# Altium schematic sheet FPGA.SchDoc
size 1270 x 1270 mm
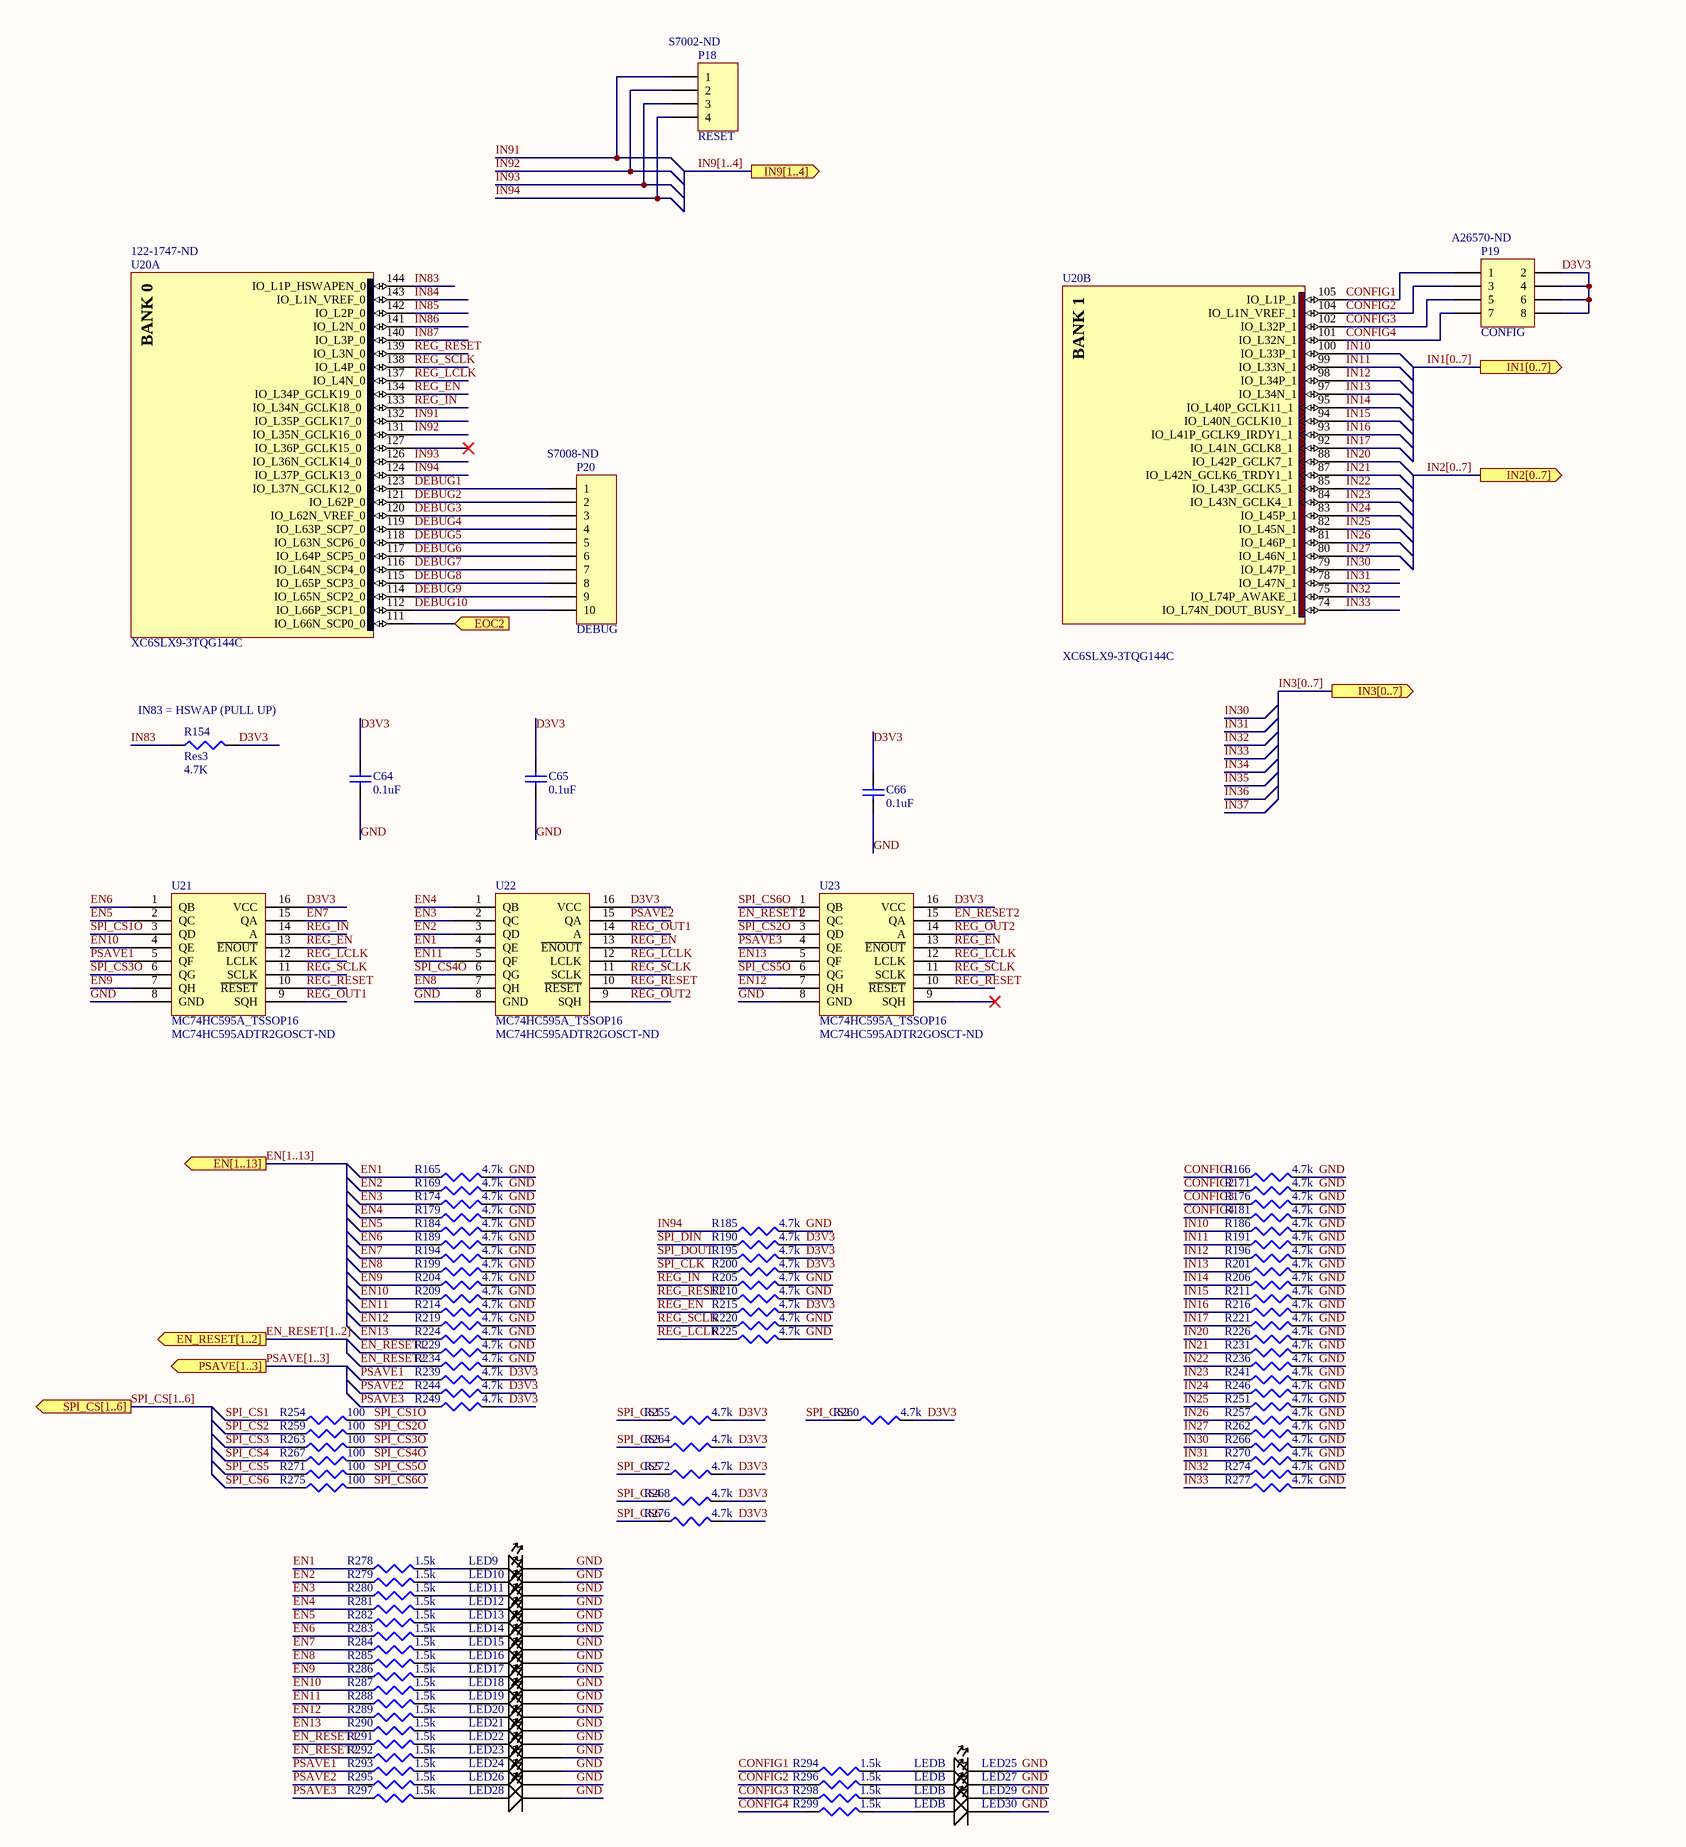
[diagram p0: FPGA.SchDoc, top left]
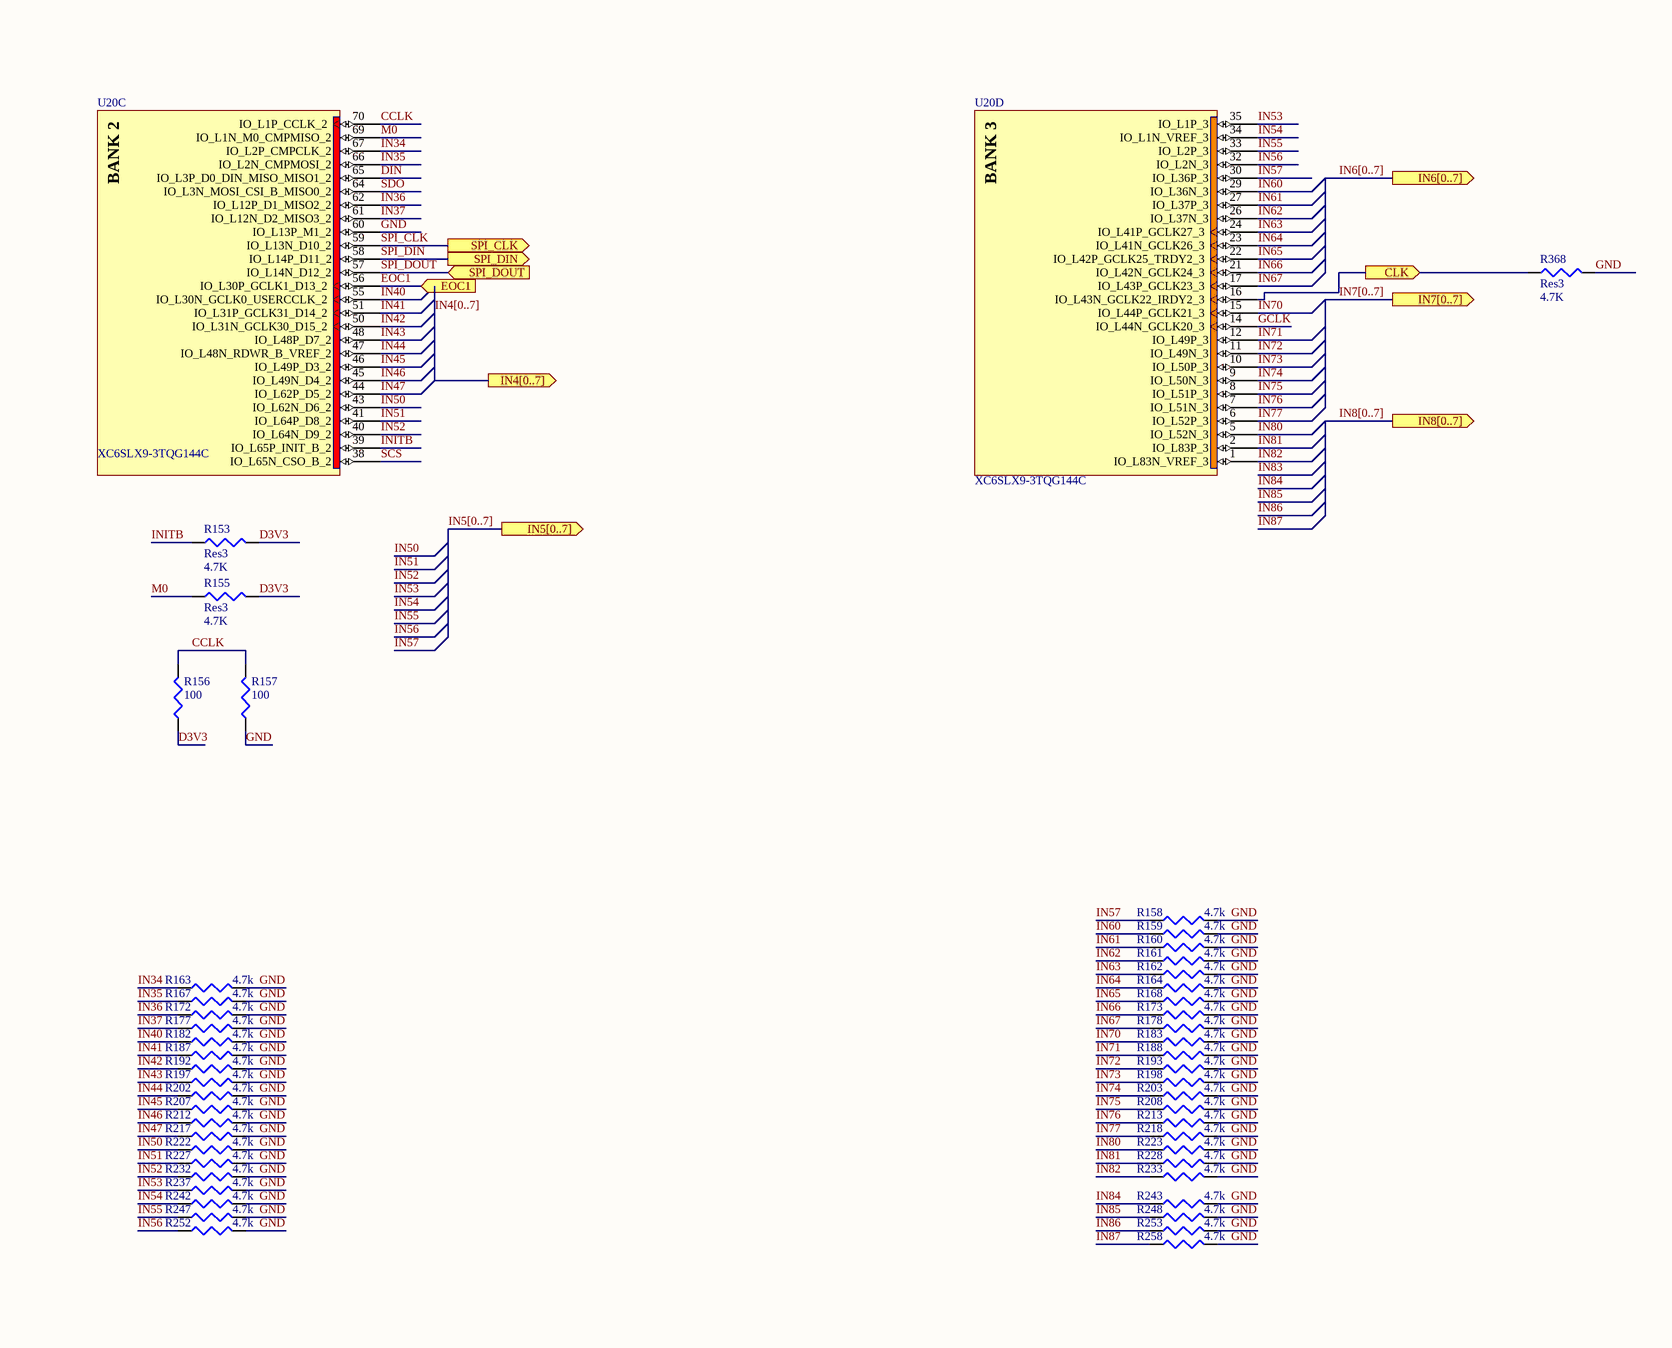
[diagram p1: FPGA.SchDoc, top right]
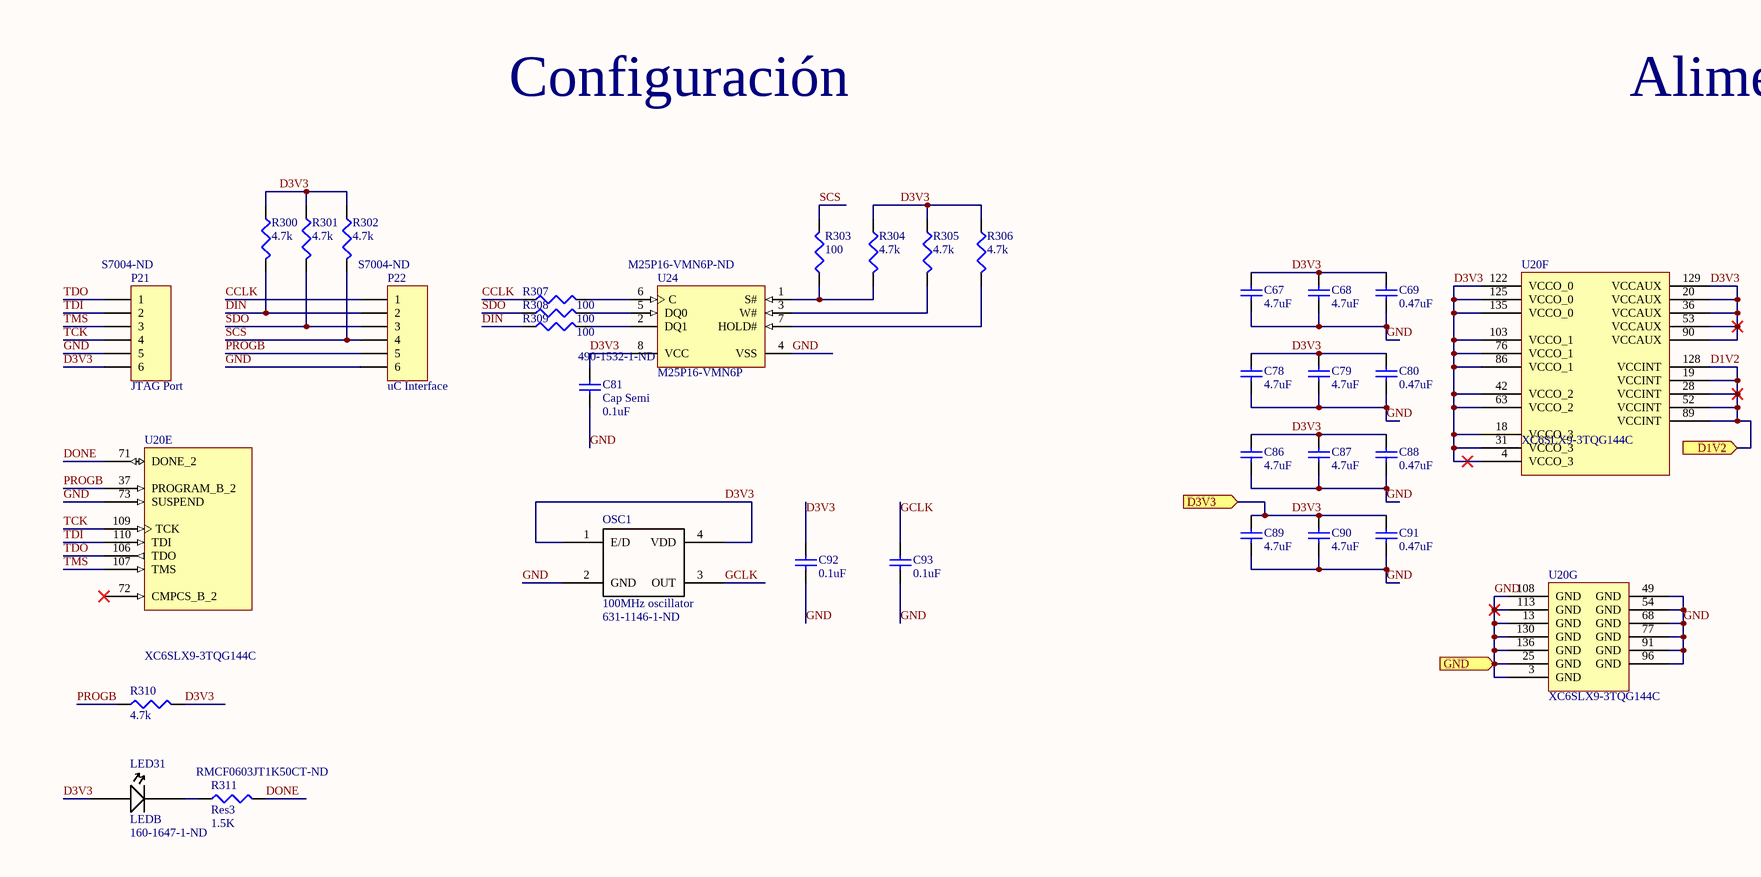
[diagram p2: FPGA.SchDoc, bottom left]
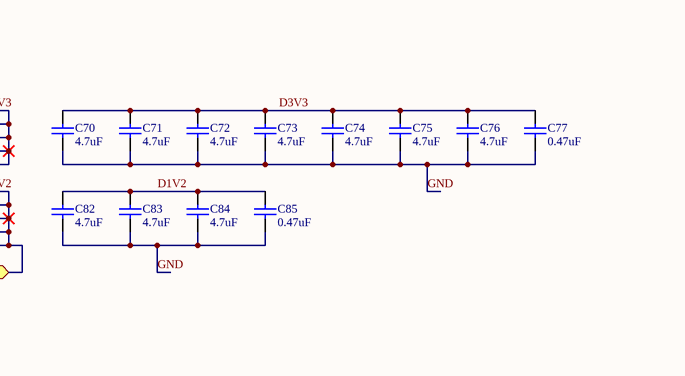
[diagram p3: FPGA.SchDoc, bottom right]

## Parts
C64  value 0.1uF  [J1-0603]  (hidden comment: Cap)
C65  value 0.1uF  [J1-0603]  (hidden comment: Cap)
C66  value 0.1uF  [J1-0603]  (hidden comment: Cap)
C67  value 4.7uF  [J1-0603]  (hidden comment: Cap)
C68  value 4.7uF  [J1-0603]  (hidden comment: Cap)
C69  value 0.47uF  [J1-0603]  (hidden comment: Cap)
C70  value 4.7uF  [J1-0603]  (hidden comment: Cap)
C71  value 4.7uF  [J1-0603]  (hidden comment: Cap)
C72  value 4.7uF  [J1-0603]  (hidden comment: Cap)
C73  value 4.7uF  [J1-0603]  (hidden comment: Cap)
C74  value 4.7uF  [J1-0603]  (hidden comment: Cap)
C75  value 4.7uF  [J1-0603]  (hidden comment: Cap)
C76  value 4.7uF  [J1-0603]  (hidden comment: Cap)
C77  value 0.47uF  [J1-0603]  (hidden comment: Cap)
C78  value 4.7uF  [J1-0603]  (hidden comment: Cap)
C79  value 4.7uF  [J1-0603]  (hidden comment: Cap)
C80  value 0.47uF  [J1-0603]  (hidden comment: Cap)
C81  Cap Semi  value 0.1uF  Supplier Part Number 1: 490-1532-1-ND  [J1-0603]
C82  value 4.7uF  [J1-0603]  (hidden comment: Cap)
C83  value 4.7uF  [J1-0603]  (hidden comment: Cap)
C84  value 4.7uF  [J1-0603]  (hidden comment: Cap)
C85  value 0.47uF  [J1-0603]  (hidden comment: Cap)
C86  value 4.7uF  [J1-0603]  (hidden comment: Cap)
C87  value 4.7uF  [J1-0603]  (hidden comment: Cap)
C88  value 0.47uF  [J1-0603]  (hidden comment: Cap)
C89  value 4.7uF  [J1-0603]  (hidden comment: Cap)
C90  value 4.7uF  [J1-0603]  (hidden comment: Cap)
C91  value 0.47uF  [J1-0603]  (hidden comment: Cap)
C92  value 0.1uF  [J1-0603]  (hidden comment: Cap)
C93  value 0.1uF  [J1-0603]  (hidden comment: Cap)
LED9  LED  [LED]  (value not drawn)
LED10  LED  [LED]  (value not drawn)
LED11  LED  [LED]  (value not drawn)
LED12  LED  [LED]  (value not drawn)
LED13  LED  [LED]  (value not drawn)
LED14  LED  [LED]  (value not drawn)
LED15  LED  [LED]  (value not drawn)
LED16  LED  [LED]  (value not drawn)
LED17  LED  [LED]  (value not drawn)
LED18  LED  [LED]  (value not drawn)
LED19  LED  [LED]  (value not drawn)
LED20  LED  [LED]  (value not drawn)
LED21  LED  [LED]  (value not drawn)
LED22  LED  [LED]  (value not drawn)
LED23  LED  [LED]  (value not drawn)
LED24  LED  [LED]  (value not drawn)
LED25  LEDB  [LED]
LED26  LED  [LED]  (value not drawn)
LED27  LEDB  [LED]
LED28  LED  [LED]  (value not drawn)
LED29  LEDB  [LED]
LED30  LEDB  [LED]
LED31  LEDB  Supplier Part Number 1: 160-1647-1-ND  [LED]
OSC1  100MHz oscillator  Supplier Part Number 1: 631-1146-1-ND  [100MHz oscillator]
P18  RESET  Supplier Part Number 1: S7002-ND  [HDR1X4]
P19  CONFIG  Supplier Part Number 1: A26570-ND  [HDR2X4]
P20  DEBUG  Supplier Part Number 1: S7008-ND  [HDR1X10]
P21  JTAG Port  Supplier Part Number 1: S7004-ND  [HDR1X6]
P22  uC Interface  Supplier Part Number 1: S7004-ND  [HDR1X6]
R153  Res3  value 4.7K  [J1-0603]
R154  Res3  value 4.7K  [J1-0603]
R155  Res3  value 4.7K  [J1-0603]
R156  value 100  [J1-0603]  (hidden comment: Res3)
R157  value 100  [J1-0603]  (hidden comment: Res3)
R158  value 4.7k  [J1-0603]  (hidden comment: Res3)
R159  value 4.7k  [J1-0603]  (hidden comment: Res3)
R160  value 4.7k  [J1-0603]  (hidden comment: Res3)
R161  value 4.7k  [J1-0603]  (hidden comment: Res3)
R162  value 4.7k  [J1-0603]  (hidden comment: Res3)
R163  value 4.7k  [J1-0603]  (hidden comment: Res3)
R164  value 4.7k  [J1-0603]  (hidden comment: Res3)
R165  value 4.7k  [J1-0603]  (hidden comment: Res3)
R166  value 4.7k  [J1-0603]  (hidden comment: Res3)
R167  value 4.7k  [J1-0603]  (hidden comment: Res3)
R168  value 4.7k  [J1-0603]  (hidden comment: Res3)
R169  value 4.7k  [J1-0603]  (hidden comment: Res3)
R171  value 4.7k  [J1-0603]  (hidden comment: Res3)
R172  value 4.7k  [J1-0603]  (hidden comment: Res3)
R173  value 4.7k  [J1-0603]  (hidden comment: Res3)
R174  value 4.7k  [J1-0603]  (hidden comment: Res3)
R176  value 4.7k  [J1-0603]  (hidden comment: Res3)
R177  value 4.7k  [J1-0603]  (hidden comment: Res3)
R178  value 4.7k  [J1-0603]  (hidden comment: Res3)
R179  value 4.7k  [J1-0603]  (hidden comment: Res3)
R181  value 4.7k  [J1-0603]  (hidden comment: Res3)
R182  value 4.7k  [J1-0603]  (hidden comment: Res3)
R183  value 4.7k  [J1-0603]  (hidden comment: Res3)
R184  value 4.7k  [J1-0603]  (hidden comment: Res3)
R185  value 4.7k  [J1-0603]  (hidden comment: Res3)
R186  value 4.7k  [J1-0603]  (hidden comment: Res3)
R187  value 4.7k  [J1-0603]  (hidden comment: Res3)
R188  value 4.7k  [J1-0603]  (hidden comment: Res3)
R189  value 4.7k  [J1-0603]  (hidden comment: Res3)
R190  value 4.7k  [J1-0603]  (hidden comment: Res3)
R191  value 4.7k  [J1-0603]  (hidden comment: Res3)
R192  value 4.7k  [J1-0603]  (hidden comment: Res3)
R193  value 4.7k  [J1-0603]  (hidden comment: Res3)
R194  value 4.7k  [J1-0603]  (hidden comment: Res3)
R195  value 4.7k  [J1-0603]  (hidden comment: Res3)
R196  value 4.7k  [J1-0603]  (hidden comment: Res3)
R197  value 4.7k  [J1-0603]  (hidden comment: Res3)
R198  value 4.7k  [J1-0603]  (hidden comment: Res3)
R199  value 4.7k  [J1-0603]  (hidden comment: Res3)
R200  value 4.7k  [J1-0603]  (hidden comment: Res3)
R201  value 4.7k  [J1-0603]  (hidden comment: Res3)
R202  value 4.7k  [J1-0603]  (hidden comment: Res3)
R203  value 4.7k  [J1-0603]  (hidden comment: Res3)
R204  value 4.7k  [J1-0603]  (hidden comment: Res3)
R205  value 4.7k  [J1-0603]  (hidden comment: Res3)
R206  value 4.7k  [J1-0603]  (hidden comment: Res3)
R207  value 4.7k  [J1-0603]  (hidden comment: Res3)
R208  value 4.7k  [J1-0603]  (hidden comment: Res3)
R209  value 4.7k  [J1-0603]  (hidden comment: Res3)
R210  value 4.7k  [J1-0603]  (hidden comment: Res3)
R211  value 4.7k  [J1-0603]  (hidden comment: Res3)
R212  value 4.7k  [J1-0603]  (hidden comment: Res3)
R213  value 4.7k  [J1-0603]  (hidden comment: Res3)
R214  value 4.7k  [J1-0603]  (hidden comment: Res3)
R215  value 4.7k  [J1-0603]  (hidden comment: Res3)
R216  value 4.7k  [J1-0603]  (hidden comment: Res3)
R217  value 4.7k  [J1-0603]  (hidden comment: Res3)
R218  value 4.7k  [J1-0603]  (hidden comment: Res3)
R219  value 4.7k  [J1-0603]  (hidden comment: Res3)
R220  value 4.7k  [J1-0603]  (hidden comment: Res3)
R221  value 4.7k  [J1-0603]  (hidden comment: Res3)
R222  value 4.7k  [J1-0603]  (hidden comment: Res3)
R223  value 4.7k  [J1-0603]  (hidden comment: Res3)
R224  value 4.7k  [J1-0603]  (hidden comment: Res3)
R225  value 4.7k  [J1-0603]  (hidden comment: Res3)
R226  value 4.7k  [J1-0603]  (hidden comment: Res3)
R227  value 4.7k  [J1-0603]  (hidden comment: Res3)
R228  value 4.7k  [J1-0603]  (hidden comment: Res3)
R229  value 4.7k  [J1-0603]  (hidden comment: Res3)
R231  value 4.7k  [J1-0603]  (hidden comment: Res3)
R232  value 4.7k  [J1-0603]  (hidden comment: Res3)
R233  value 4.7k  [J1-0603]  (hidden comment: Res3)
R234  value 4.7k  [J1-0603]  (hidden comment: Res3)
R236  value 4.7k  [J1-0603]  (hidden comment: Res3)
R237  value 4.7k  [J1-0603]  (hidden comment: Res3)
R239  value 4.7k  [J1-0603]  (hidden comment: Res3)
R241  value 4.7k  [J1-0603]  (hidden comment: Res3)
R242  value 4.7k  [J1-0603]  (hidden comment: Res3)
R243  value 4.7k  [J1-0603]  (hidden comment: Res3)
R244  value 4.7k  [J1-0603]  (hidden comment: Res3)
R246  value 4.7k  [J1-0603]  (hidden comment: Res3)
R247  value 4.7k  [J1-0603]  (hidden comment: Res3)
R248  value 4.7k  [J1-0603]  (hidden comment: Res3)
R249  value 4.7k  [J1-0603]  (hidden comment: Res3)
R251  value 4.7k  [J1-0603]  (hidden comment: Res3)
R252  value 4.7k  [J1-0603]  (hidden comment: Res3)
R253  value 4.7k  [J1-0603]  (hidden comment: Res3)
R254  value 100  [J1-0603]  (hidden comment: Res3)
R255  value 4.7k  [J1-0603]  (hidden comment: Res3)
R257  value 4.7k  [J1-0603]  (hidden comment: Res3)
R258  value 4.7k  [J1-0603]  (hidden comment: Res3)
R259  value 100  [J1-0603]  (hidden comment: Res3)
R260  value 4.7k  [J1-0603]  (hidden comment: Res3)
R262  value 4.7k  [J1-0603]  (hidden comment: Res3)
R263  value 100  [J1-0603]  (hidden comment: Res3)
R264  value 4.7k  [J1-0603]  (hidden comment: Res3)
R266  value 4.7k  [J1-0603]  (hidden comment: Res3)
R267  value 100  [J1-0603]  (hidden comment: Res3)
R268  value 4.7k  [J1-0603]  (hidden comment: Res3)
R270  value 4.7k  [J1-0603]  (hidden comment: Res3)
R271  value 100  [J1-0603]  (hidden comment: Res3)
R272  value 4.7k  [J1-0603]  (hidden comment: Res3)
R274  value 4.7k  [J1-0603]  (hidden comment: Res3)
R275  value 100  [J1-0603]  (hidden comment: Res3)
R276  value 4.7k  [J1-0603]  (hidden comment: Res3)
R277  value 4.7k  [J1-0603]  (hidden comment: Res3)
R278  value 1.5k  [J1-0603]  (hidden comment: Res3)
R279  value 1.5k  [J1-0603]  (hidden comment: Res3)
R280  value 1.5k  [J1-0603]  (hidden comment: Res3)
R281  value 1.5k  [J1-0603]  (hidden comment: Res3)
R282  value 1.5k  [J1-0603]  (hidden comment: Res3)
R283  value 1.5k  [J1-0603]  (hidden comment: Res3)
R284  value 1.5k  [J1-0603]  (hidden comment: Res3)
R285  value 1.5k  [J1-0603]  (hidden comment: Res3)
R286  value 1.5k  [J1-0603]  (hidden comment: Res3)
R287  value 1.5k  [J1-0603]  (hidden comment: Res3)
R288  value 1.5k  [J1-0603]  (hidden comment: Res3)
R289  value 1.5k  [J1-0603]  (hidden comment: Res3)
R290  value 1.5k  [J1-0603]  (hidden comment: Res3)
R291  value 1.5k  [J1-0603]  (hidden comment: Res3)
R292  value 1.5k  [J1-0603]  (hidden comment: Res3)
R293  value 1.5k  [J1-0603]  (hidden comment: Res3)
R294  value 1.5k  [J1-0603]  (hidden comment: Res3)
R295  value 1.5k  [J1-0603]  (hidden comment: Res3)
R296  value 1.5k  [J1-0603]  (hidden comment: Res3)
R297  value 1.5k  [J1-0603]  (hidden comment: Res3)
R298  value 1.5k  [J1-0603]  (hidden comment: Res3)
R299  value 1.5k  [J1-0603]  (hidden comment: Res3)
R300  value 4.7k  [J1-0603]  (hidden comment: Res3)
R301  value 4.7k  [J1-0603]  (hidden comment: Res3)
R302  value 4.7k  [J1-0603]  (hidden comment: Res3)
R303  value 100  [J1-0603]  (hidden comment: Res3)
R304  value 4.7k  [J1-0603]  (hidden comment: Res3)
R305  value 4.7k  [J1-0603]  (hidden comment: Res3)
R306  value 4.7k  [J1-0603]  (hidden comment: Res3)
R307  value 100  [J1-0603]  (hidden comment: Res3)
R308  value 100  [J1-0603]  (hidden comment: Res3)
R309  value 100  [J1-0603]  (hidden comment: Res3)
R310  value 4.7k  [J1-0603]  (hidden comment: Res3)
R311  Res3  value 1.5K  Supplier Part Number 1: RMCF0603JT1K50CT-ND  [J1-0603]
R368  Res3  value 4.7K  [J1-0603]
U20  XC6SLX9-3TQG144C  Supplier Part Number 1: 122-1747-ND  [TQG144_N]  (parts A,B,C,D,E,F,G of 7)
U21  MC74HC595A_TSSOP16  Supplier Part Number 1: MC74HC595ADTR2GOSCT-ND  [MC74HC595A_TSSOP16]
U22  MC74HC595A_TSSOP16  Supplier Part Number 1: MC74HC595ADTR2GOSCT-ND  [MC74HC595A_TSSOP16]
U23  MC74HC595A_TSSOP16  Supplier Part Number 1: MC74HC595ADTR2GOSCT-ND  [MC74HC595A_TSSOP16]
U24  M25P16-VMN6P  Supplier Part Number 1: M25P16-VMN6P-ND  [MICT-MN-8_N]

## Ports
CLK (out), D1V2 (in), D3V3 (in), EN[1..13] (out), EN_RESET[1..2] (out), EOC1 (in), EOC2 (in), GND (in), IN1[0..7] (out), IN2[0..7] (out), IN3[0..7] (out), IN4[0..7] (out), IN5[0..7] (out), IN6[0..7] (out), IN7[0..7] (out), IN8[0..7] (out), IN9[1..4] (out), PSAVE[1..3] (out), SPI_CLK (out), SPI_CS[1..6] (out), SPI_DIN (out), SPI_DOUT (in)

## Nets
CCLK: P22.1 R156.2 R157.2 R307.1 U20.70(IO_L1P_CCLK_2)
CLK: R368.1 U20.16(IO_L43N_GCLK22_IRDY2_3) ; port CLK
CONFIG1: P19.1 R166.1 R294.1 U20.105(IO_L1P_1)
CONFIG2: P19.3 R171.1 R296.1 U20.104(IO_L1N_VREF_1)
CONFIG3: P19.5 R176.1 R298.1 U20.102(IO_L32P_1)
CONFIG4: P19.7 R181.1 R299.1 U20.101(IO_L32N_1)
D1V2: C82.1 C83.1 C84.1 C85.1 U20.19(VCCINT) U20.28(VCCINT) U20.52(VCCINT) U20.89(VCCINT) U20.128(VCCINT) ; port D1V2
D3V3: C64.1 C65.1 C66.1 C67.1 C68.1 C69.1 C70.1 C71.1 C72.1 C73.1 C74.1 C75.1 C76.1 C77.1 C78.1 C79.1 C80.1 C81.2 C86.1 C87.1 C88.1 C89.1 C90.1 C91.1 C92.1 LED31.1 OSC1.1(E/D) OSC1.4(VDD) P19.2 P19.4 P19.6 P19.8 P21.6 R153.2 R154.2 R155.2 R156.1 R190.2 R195.2 R200.2 R215.2 R239.2 R244.2 R249.2 R255.2 R260.2 R264.2 R268.2 R272.2 R276.2 R300.1 R301.1 R302.1 R304.1 R305.1 R306.1 R310.2 U20.4(VCCO_3) U20.18(VCCO_3) U20.20(VCCAUX) U20.31(VCCO_3) U20.36(VCCAUX) U20.42(VCCO_2) U20.53(VCCAUX) U20.63(VCCO_2) U20.76(VCCO_1) U20.86(VCCO_1) U20.90(VCCAUX) U20.103(VCCO_1) U20.122(VCCO_0) U20.125(VCCO_0) U20.129(VCCAUX) U20.135(VCCO_0) U21.16(VCC) U22.16(VCC) U23.16(VCC) U24.8(VCC) ; port D3V3
DEBUG1: P20.1 U20.123(IO_L37N_GCLK12_0)
DEBUG2: P20.2 U20.121(IO_L62P_0)
DEBUG3: P20.3 U20.120(IO_L62N_VREF_0)
DEBUG4: P20.4 U20.119(IO_L63P_SCP7_0)
DEBUG5: P20.5 U20.118(IO_L63N_SCP6_0)
DEBUG6: P20.6 U20.117(IO_L64P_SCP5_0)
DEBUG7: P20.7 U20.116(IO_L64N_SCP4_0)
DEBUG8: P20.8 U20.115(IO_L65P_SCP3_0)
DEBUG9: P20.9 U20.114(IO_L65N_SCP2_0)
DEBUG10: P20.10 U20.112(IO_L66P_SCP1_0)
DIN: P22.2 R300.2 R309.1 U20.65(IO_L3P_D0_DIN_MISO_MISO1_2)
DONE: R311.2 U20.71(DONE_2)
EN1: R165.1 R278.1 U22.4(QE)
EN2: R169.1 R279.1 U22.3(QD)
EN3: R174.1 R280.1 U22.2(QC)
EN4: R179.1 R281.1 U22.1(QB)
EN5: R184.1 R282.1 U21.2(QC)
EN6: R189.1 R283.1 U21.1(QB)
EN7: R194.1 R284.1 U21.15(QA)
EN8: R199.1 R285.1 U22.7(QH)
EN9: R204.1 R286.1 U21.7(QH)
EN10: R209.1 R287.1 U21.4(QE)
EN11: R214.1 R288.1 U22.5(QF)
EN12: R219.1 R289.1 U23.7(QH)
EN13: R224.1 R290.1 U23.5(QF)
EN_RESET1: R229.1 R291.1 U23.2(QC)
EN_RESET2: R234.1 R292.1 U23.15(QA)
EOC1: U20.56(IO_L30P_GCLK1_D13_2) ; port EOC1
EOC2: U20.111(IO_L66N_SCP0_0) ; port EOC2
GCLK: C93.1 OSC1.3(OUT) U20.14(IO_L44N_GCLK20_3)
GND: C64.2 C65.2 C66.2 C67.2 C68.2 C69.2 C70.2 C71.2 C72.2 C73.2 C74.2 C75.2 C76.2 C77.2 C78.2 C79.2 C80.2 C81.1 C82.2 C83.2 C84.2 C85.2 C86.2 C87.2 C88.2 C89.2 C90.2 C91.2 C92.2 C93.2 LED9.2 LED10.2 LED11.2 LED12.2 LED13.2 LED14.2 LED15.2 LED16.2 LED17.2 LED18.2 LED19.2 LED20.2 LED21.2 LED22.2 LED23.2 LED24.2 LED25.2 LED26.2 LED27.2 LED28.2 LED29.2 LED30.2 OSC1.2(GND) P21.5 P22.6 R157.1 R158.2 R159.2 R160.2 R161.2 R162.2 R163.2 R164.2 R165.2 R166.2 R167.2 R168.2 R169.2 R171.2 R172.2 R173.2 R174.2 R176.2 R177.2 R178.2 R179.2 R181.2 R182.2 R183.2 R184.2 R185.2 R186.2 R187.2 R188.2 R189.2 R191.2 R192.2 R193.2 R194.2 R196.2 R197.2 R198.2 R199.2 R201.2 R202.2 R203.2 R204.2 R205.2 R206.2 R207.2 R208.2 R209.2 R210.2 R211.2 R212.2 R213.2 R214.2 R216.2 R217.2 R218.2 R219.2 R220.2 R221.2 R222.2 R223.2 R224.2 R225.2 R226.2 R227.2 R228.2 R229.2 R231.2 R232.2 R233.2 R234.2 R236.2 R237.2 R241.2 R242.2 R243.2 R246.2 R247.2 R248.2 R251.2 R252.2 R253.2 R257.2 R258.2 R262.2 R266.2 R270.2 R274.2 R277.2 R368.2 U20.3(GND) U20.13(GND) U20.25(GND) U20.49(GND) U20.54(GND) U20.60(IO_L13P_M1_2) U20.68(GND) U20.73(SUSPEND) U20.77(GND) U20.91(GND) U20.96(GND) U20.108(GND) U20.113(GND) U20.130(GND) U20.136(GND) U21.8(GND) U22.8(GND) U23.8(GND) U24.4(VSS) ; port GND
IN10: R186.1 U20.100(IO_L33P_1)
IN11: R191.1 U20.99(IO_L33N_1)
IN12: R196.1 U20.98(IO_L34P_1)
IN13: R201.1 U20.97(IO_L34N_1)
IN14: R206.1 U20.95(IO_L40P_GCLK11_1)
IN15: R211.1 U20.94(IO_L40N_GCLK10_1)
IN16: R216.1 U20.93(IO_L41P_GCLK9_IRDY1_1)
IN17: R221.1 U20.92(IO_L41N_GCLK8_1)
IN20: R226.1 U20.88(IO_L42P_GCLK7_1)
IN21: R231.1 U20.87(IO_L42N_GCLK6_TRDY1_1)
IN22: R236.1 U20.85(IO_L43P_GCLK5_1)
IN23: R241.1 U20.84(IO_L43N_GCLK4_1)
IN24: R246.1 U20.83(IO_L45P_1)
IN25: R251.1 U20.82(IO_L45N_1)
IN26: R257.1 U20.81(IO_L46P_1)
IN27: R262.1 U20.80(IO_L46N_1)
IN30: R266.1 U20.79(IO_L47P_1)
IN31: R270.1 U20.78(IO_L47N_1)
IN32: R274.1 U20.75(IO_L74P_AWAKE_1)
IN33: R277.1 U20.74(IO_L74N_DOUT_BUSY_1)
IN34: R163.1 U20.67(IO_L2P_CMPCLK_2)
IN35: R167.1 U20.66(IO_L2N_CMPMOSI_2)
IN36: R172.1 U20.62(IO_L12P_D1_MISO2_2)
IN37: R177.1 U20.61(IO_L12N_D2_MISO3_2)
IN40: R182.1 U20.55(IO_L30N_GCLK0_USERCCLK_2)
IN41: R187.1 U20.51(IO_L31P_GCLK31_D14_2)
IN42: R192.1 U20.50(IO_L31N_GCLK30_D15_2)
IN43: R197.1 U20.48(IO_L48P_D7_2)
IN44: R202.1 U20.47(IO_L48N_RDWR_B_VREF_2)
IN45: R207.1 U20.46(IO_L49P_D3_2)
IN46: R212.1 U20.45(IO_L49N_D4_2)
IN47: R217.1 U20.44(IO_L62P_D5_2)
IN50: R222.1 U20.43(IO_L62N_D6_2)
IN51: R227.1 U20.41(IO_L64P_D8_2)
IN52: R232.1 U20.40(IO_L64N_D9_2)
IN53: R237.1 U20.35(IO_L1P_3)
IN54: R242.1 U20.34(IO_L1N_VREF_3)
IN55: R247.1 U20.33(IO_L2P_3)
IN56: R252.1 U20.32(IO_L2N_3)
IN57: R158.1 U20.30(IO_L36P_3)
IN60: R159.1 U20.29(IO_L36N_3)
IN61: R160.1 U20.27(IO_L37P_3)
IN62: R161.1 U20.26(IO_L37N_3)
IN63: R162.1 U20.24(IO_L41P_GCLK27_3)
IN64: R164.1 U20.23(IO_L41N_GCLK26_3)
IN65: R168.1 U20.22(IO_L42P_GCLK25_TRDY2_3)
IN66: R173.1 U20.21(IO_L42N_GCLK24_3)
IN67: R178.1 U20.17(IO_L43P_GCLK23_3)
IN70: R183.1 U20.15(IO_L44P_GCLK21_3)
IN71: R188.1 U20.12(IO_L49P_3)
IN72: R193.1 U20.11(IO_L49N_3)
IN73: R198.1 U20.10(IO_L50P_3)
IN74: R203.1 U20.9(IO_L50N_3)
IN75: R208.1 U20.8(IO_L51P_3)
IN76: R213.1 U20.7(IO_L51N_3)
IN77: R218.1 U20.6(IO_L52P_3)
IN80: R223.1 U20.5(IO_L52N_3)
IN81: R228.1 U20.2(IO_L83P_3)
IN82: R233.1 U20.1(IO_L83N_VREF_3)
IN83: R154.1 U20.144(IO_L1P_HSWAPEN_0)
IN84: R243.1 U20.143(IO_L1N_VREF_0)
IN85: R248.1 U20.142(IO_L2P_0)
IN86: R253.1 U20.141(IO_L2N_0)
IN87: R258.1 U20.140(IO_L3P_0)
IN91: P18.1 U20.132(IO_L35P_GCLK17_0)
IN92: P18.2 U20.131(IO_L35N_GCLK16_0)
IN93: P18.3 U20.126(IO_L36N_GCLK14_0)
IN94: P18.4 R185.1 U20.124(IO_L37P_GCLK13_0)
INITB: R153.1 U20.39(IO_L65P_INIT_B_2)
M0: R155.1 U20.69(IO_L1N_M0_CMPMISO_2)
PROGB: P22.5 R310.1 U20.37(PROGRAM_B_2)
PSAVE1: R239.1 R293.1 U21.5(QF)
PSAVE2: R244.1 R295.1 U22.15(QA)
PSAVE3: R249.1 R297.1 U23.4(QE)
REG_EN: R215.1 U20.134(IO_L34P_GCLK19_0) U21.13(~{ENOUT}) U22.13(~{ENOUT}) U23.13(~{ENOUT})
REG_IN: R205.1 U20.133(IO_L34N_GCLK18_0) U21.14(A)
REG_LCLK: R225.1 U20.137(IO_L4N_0) U21.12(LCLK) U22.12(LCLK) U23.12(LCLK)
REG_OUT1: U21.9(SQH) U22.14(A)
REG_OUT2: U22.9(SQH) U23.14(A)
REG_RESET: R210.1 U20.139(IO_L3N_0) U21.10(~{RESET}) U22.10(~{RESET}) U23.10(~{RESET})
REG_SCLK: R220.1 U20.138(IO_L4P_0) U21.11(SCLK) U22.11(SCLK) U23.11(SCLK)
SCS: P22.4 R302.2 R303.2 U20.38(IO_L65N_CSO_B_2)
SDO: P22.3 R301.2 R308.1 U20.64(IO_L3N_MOSI_CSI_B_MISO0_2)
SPI_CLK: R200.1 U20.59(IO_L13N_D10_2) ; port SPI_CLK
SPI_CS1: R254.1 R255.1
SPI_CS1O: R254.2 U21.3(QD)
SPI_CS2: R259.1 R260.1
SPI_CS2O: R259.2 U23.3(QD)
SPI_CS3: R263.1 R264.1
SPI_CS3O: R263.2 U21.6(QG)
SPI_CS4: R267.1 R268.1
SPI_CS4O: R267.2 U22.6(QG)
SPI_CS5: R271.1 R272.1
SPI_CS5O: R271.2 U23.6(QG)
SPI_CS6: R275.1 R276.1
SPI_CS6O: R275.2 U23.1(QB)
SPI_DIN: R190.1 U20.58(IO_L14P_D11_2) ; port SPI_DIN
SPI_DOUT: R195.1 U20.57(IO_L14N_D12_2) ; port SPI_DOUT
TCK: P21.4 U20.109(TCK)
TDI: P21.2 U20.110(TDI)
TDO: P21.1 U20.106(TDO)
TMS: P21.3 U20.107(TMS)
NetLED9_1: LED9.1 R278.2
NetLED10_1: LED10.1 R279.2
NetLED11_1: LED11.1 R280.2
NetLED12_1: LED12.1 R281.2
NetLED13_1: LED13.1 R282.2
NetLED14_1: LED14.1 R283.2
NetLED15_1: LED15.1 R284.2
NetLED16_1: LED16.1 R285.2
NetLED17_1: LED17.1 R286.2
NetLED18_1: LED18.1 R287.2
NetLED19_1: LED19.1 R288.2
NetLED20_1: LED20.1 R289.2
NetLED21_1: LED21.1 R290.2
NetLED22_1: LED22.1 R291.2
NetLED23_1: LED23.1 R292.2
NetLED24_1: LED24.1 R293.2
NetLED25_1: LED25.1 R294.2
NetLED26_1: LED26.1 R295.2
NetLED27_1: LED27.1 R296.2
NetLED28_1: LED28.1 R297.2
NetLED29_1: LED29.1 R298.2
NetLED30_1: LED30.1 R299.2
NetLED31_2: LED31.2 R311.1
NetR303_1: R303.1 R304.2 U24.1(S#)
NetR305_2: R305.2 U24.3(W#)
NetR306_2: R306.2 U24.7(HOLD#)
NetR307_2: R307.2 U24.6(C)
NetR308_2: R308.2 U24.5(DQ0)
NetR309_2: R309.2 U24.2(DQ1)

Not connected (* = marked no-connect by the designer): U20 72(CMPCS_B_2)* 127(IO_L36P_GCLK15_0)*; U23 9(SQH)*

## Buses and harness runs
bus EN[1..13] = port EN[1..13]
bus EN_RESET[1..2] = port EN_RESET[1..2]
bus IN1[0..7] = port IN1[0..7]
bus IN2[0..7] = port IN2[0..7]
bus IN3[0..7] = port IN3[0..7]
bus IN4[0..7] = port IN4[0..7]
bus IN5[0..7] = port IN5[0..7]
bus IN6[0..7] = port IN6[0..7]
bus IN7[0..7] = port IN7[0..7]
bus IN8[0..7] = port IN8[0..7]
bus IN9[1..4] = port IN9[1..4]
bus PSAVE[1..3] = port PSAVE[1..3]
bus SPI_CS[1..6] = port SPI_CS[1..6]

## Notes on the sheet
- (near R154) IN83 = HSWAP (PULL UP)
- Configuración
- Alimentación
- (in symbol XC6SLX9-3TQG144C, part A) BANK 0
- (in symbol XC6SLX9-3TQG144C, part B) BANK 1
- (in symbol XC6SLX9-3TQG144C, part C) BANK 2
- (in symbol XC6SLX9-3TQG144C, part D) BANK 3

## Library data of the parts
C64-C80 C82-C93 = Cap: Capacitor; Published: 8-Jun-2000; LatestRevisionDate: 17-Jul-2002; LatestRevisionNote: Re-released for DXP Platform.; PackageReference: RAD-0.3; Publisher: Altium Limited; PackageDescription: Radial Cap, Thru-Hole; 2 Leads; 0.3 in Pin Spacing; Supplier 1: Digi-Key
  C64-C66 C92 C93: Supplier Part Number 1: 490-1532-1-ND
  C67 C68 C70-C76 C78 C79 C82-C84 C86 C87 C89 C90: Supplier Part Number 1: 1276-2087-1-ND
  C69 C77 C80 C85 C88 C91: Supplier Part Number 1: 1276-1062-1-ND
C81 = Cap Semi: Capacitor (Semiconductor SIM Model); Published: 8-Jun-2000; LatestRevisionDate: 29-May-2009; LatestRevisionNote: IPC-7351 Footprint Added.; PackageReference: C1206; Publisher: Altium Limited; PackageDescription: Chip Capacitor; Supplier 1: Digi-Key
P18 = Header 4: Header, 4-Pin; LatestRevisionDate: 17-Jul-2002; LatestRevisionNote: Re-released for DXP Platform.; Publisher: Altium Limited; Supplier 1: Digi-Key
P19 = Header 4X2: Header, 4-Pin, Dual row; LatestRevisionDate: 17-Jul-2002; LatestRevisionNote: Re-released for DXP Platform.; Publisher: Altium Limited; Supplier 1: Digi-Key
P20 = Header 10: Header, 10-Pin; LatestRevisionDate: 17-Jul-2002; LatestRevisionNote: Re-released for DXP Platform.; Publisher: Altium Limited; Supplier 1: Digi-Key
P21 P22 = Header 6: Header, 6-Pin; LatestRevisionDate: 17-Jul-2002; LatestRevisionNote: Re-released for DXP Platform.; Publisher: Altium Limited; Supplier 1: Digi-Key
R153-R169 R171-R174 R176-R179 R181-R229 R231-R234 R236 R237 R239 R241-R244 R246-R249 R251-R255 R257-R260 R262-R264 R266-R268 R270-R272 R274-R311 R368 = Res3: Resistor; Published: 8-Jun-2000; LatestRevisionDate: 29-May-2009; LatestRevisionNote: IPC-7351 Footprint Added.; PackageReference: J1-0603; Publisher: Altium Limited; PackageDescription: Chip Resistor; Supplier 1: Digi-Key
  R153-R155 R163 R165-R167 R169 R171 R172 R174 R176 R177 R179 R181 R182 R184-R187 R189-R192 R194-R197 R199-R202 R204-R207 R209-R212 R214-R217 R219-R222 R224-R227 R229 R231 R232 R234 R236 R237 R239 R241 R242 R244 R246 R247 R249 R251 R252 R255 R257 R260 R262 R264 R266 R268 R270 R272 R274 R276 R277 R300-R302 R304-R306 R310 R368: Supplier Part Number 1: P4.7KGCT-ND
  R156 R157 R254 R259 R263 R267 R271 R275 R303 R307-R309: Supplier Part Number 1: P100GCT-ND
  R158-R162 R164 R168 R173 R178 R183 R188 R193 R198 R203 R208 R213 R218 R223 R228 R233 R243 R248 R253 R258 R278-R299: Supplier Part Number 1: RMCF0603JT1K50CT-ND
U20 = XC6SLX9-3TQG144C: Spartan-6 LX 1.2V FPGA, 102 User I/Os, 144-Pin TQFP (0.5mm Pitch), Speed Grade 3, Commercial Grade, Pb-Free; DatasheetVersion: ver1.6, Nov-2010; PackageVersion: ver1.2, Jun-2004; PackageReference: TQG144; PackageDescription: 144-Pin Thin Quad Flat Pack (TQG144) - Pb-Free; Code_JEDEC: MS-026-BFB; ComponentLink1Description: Manufacturer URL; ComponentLink1URL: http://www.xilinx.com/; ComponentLink2Description: Spartan-6 Datasheet; ComponentLink2URL: http://www.xilinx.com/support/documentation/data_sheets/ds160.pdf; ComponentLink3Description: Spartan-6 Documents; ComponentLink3URL: http://www.xilinx.com/support/documentation/spartan-6.htm; Supplier 1: Digi-Key
U24 = M25P16-VMN6P: 16 Mb (x1) Serial NOR Flash Memory, 75 MHz, 2.7 to 3.6 V, 8-pin SO8 Narrow (MN), Tube; Part Family: M25P; Manufacturer: Micron; Density: 16Mb; Speed: 75 MHz; Voltage: 2.7V-3.6V; DatasheetVersion: Rev. Y; PackageVersion: Rev 11; PackageReference: MICT-MN-8; PackageDescription: 8-Pin SO Narrow, 3.9 X 4.9 mm, Pitch 1.27 mm; Applications: Embedded; Package: SO8 Narrow; Part Status: Production; RoHS: Yes; Type: Data Storage; Width: x1; Mounting Technology: Surface Mount; PartNumber: M25P16-VMN6P; ComponentLink1Description: Manufacturer URL; ComponentLink1URL: http://www.micron.com/; ComponentLink2Description: Datasheet; ComponentLink2URL: http://www.micron.com/~/media/Documents/Products/Data%20Sheet/NOR%20Flash/Serial%20NOR/M25P/M25P16.pdf; ComponentLink3Description: Package Specification; ComponentLink3URL: http://www.micron.com/~/media/Documents/Products/Data%20Sheet/NOR%20Flash/Serial%20NOR/M25P/M25P05A.pdf; Supplier 1: Digi-Key
LED9-LED24 LED26 LED28 = LED: Supplier 1: Digi-Key; Supplier Part Number 1: 160-1446-1-ND
LED25 LED27 LED29-LED31 = LEDB: Supplier 1: Digi-Key
  LED25 LED27 LED29 LED30: Supplier Part Number 1: 160-1647-1-ND
OSC1 = 100MHz oscillator: Supplier 1: Digi-Key
U21-U23 = MC74HC595A_TSSOP16: Supplier 1: Digi-Key